# Altium schematic sheet Board2Board.SchDoc
size A4; CompanyName: Technische Hochschule Nürnberg Georg Simon Ohm; Organization: UltraZohm; Address1: Kesslerplatz 12; Address2: 90489 Nürnberg; Address3: GERMANY; SheetNumber: 2; SheetTotal: 36; Website: www.ultrazohm.com
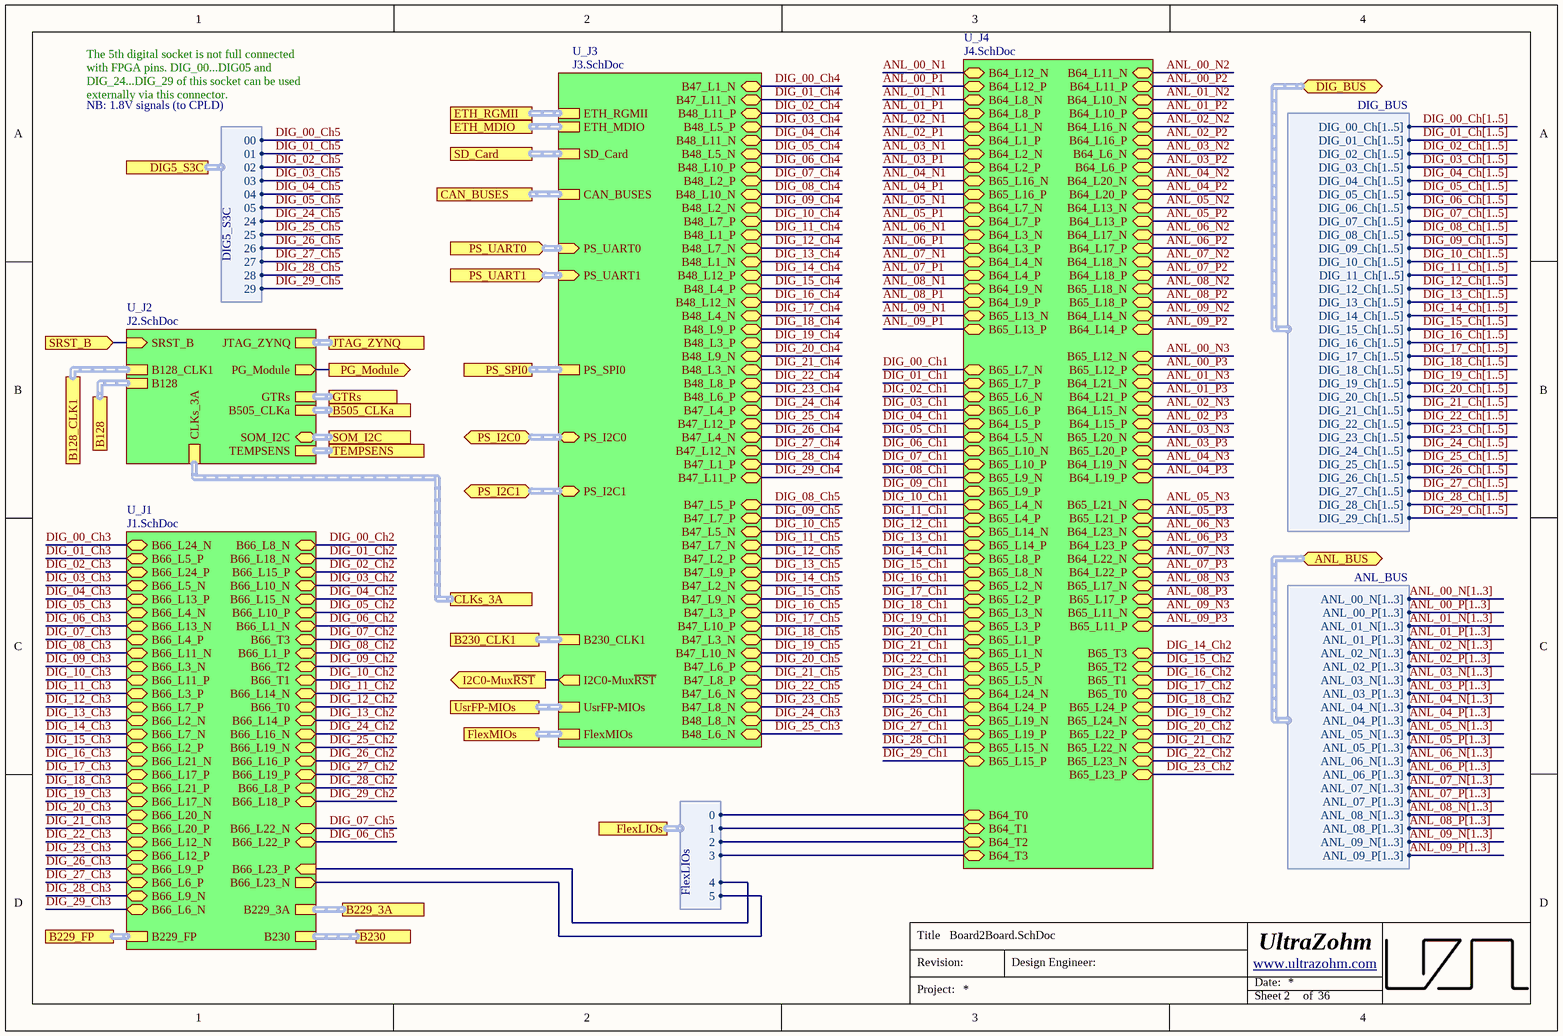
[diagram p0: Board2Board.SchDoc]

## Sub-sheets
U_J1 = J1.SchDoc: B66_L1_P (bidir), B66_L1_N (bidir), B66_L5_P (bidir), B66_L5_N (bidir), B66_L6_P (bidir), B66_L6_N (bidir), B66_L4_N (bidir), B66_L4_P (bidir), B66_L2_N (bidir), B66_L24_N (bidir), B66_L9_N (bidir), B66_L8_N (bidir), B66_L23_N (out), B66_L20_N (bidir), B66_L12_N (bidir), B66_L24_P (bidir), B66_L8_P (bidir), B66_L18_N (bidir), B66_L21_N (bidir), B66_L7_P (bidir), B66_L19_P (bidir), B66_L11_N (bidir), B66_L20_P (bidir), B66_L21_P (bidir), B66_L9_P (bidir), B66_L10_P (bidir), B66_L22_P (bidir), B66_L16_N (bidir), B66_L3_P (bidir), B66_L17_N (bidir), B66_L15_P (bidir), B66_L16_P (bidir), B66_L19_N (bidir), B66_L14_N (bidir), B66_L17_P (bidir), B66_L7_N (bidir), B66_L3_N (bidir), B66_L10_N (bidir), B66_L15_N (bidir), B66_L22_N (bidir), B66_L14_P (bidir), B66_L11_P (bidir), B66_L2_P (bidir), B66_L13_P (bidir), B66_L23_P (in), B66_L18_P (bidir), B66_L12_P (bidir), B66_L13_N (bidir), B66_T1 (bidir), B66_T2 (bidir), B66_T0 (bidir), B66_T3 (bidir), B229_3A (harness MGT3), B230 (harness MGT4), B229_FP (harness GTH)
U_J2 = J2.SchDoc: SRST_B (in), PG_Module (out), SOM_I2C (bidir, harness I2C), GTRs (harness GTRs), JTAG_ZYNQ (harness JTAG), TEMPSENS (harness T_DIODE), B505_CLKa (harness MGTCLK), CLKs_3A (harness CLKs_3A), B128 (harness MGT4), B128_CLK1 (harness MGTCLK)
U_J3 = J3.SchDoc: B48_L9_P (bidir), B47_L6_P (bidir), B48_L2_P (bidir), B48_L8_N (bidir), B48_L1_P (bidir), B47_L8_N (bidir), B47_L10_P (bidir), B47_L12_P (bidir), B47_L8_P (bidir), B47_L9_P (bidir), B48_L12_P (bidir), B48_L2_N (bidir), B47_L4_P (bidir), B47_L2_P (bidir), B47_L10_N (bidir), B48_L12_N (bidir), B47_L2_N (bidir), B47_L3_N (bidir), B48_L6_N (bidir), B48_L3_P (bidir), B47_L3_P (bidir), B47_L7_N (bidir), B48_L11_N (bidir), B48_L4_P (bidir), B47_L5_P (bidir), B47_L1_N (bidir), B47_L1_P (bidir), B47_L6_N (bidir), B48_L5_P (bidir), B48_L10_P (bidir), B47_L5_N (bidir), B48_L3_N (bidir), B47_L7_P (bidir), B48_L1_N (bidir), B48_L5_N (bidir), B47_L12_N (bidir), B48_L9_N (bidir), B48_L11_P (bidir), B47_L9_N (bidir), B48_L4_N (bidir), B47_L4_N (bidir), B48_L6_P (bidir), B47_L11_P (bidir), B48_L8_P (bidir), B48_L10_N (bidir), B47_L11_N (bidir), B48_L7_P (bidir), B48_L7_N (bidir), PS_UART0 (in, harness UART), PS_UART1 (in, harness UART), PS_I2C1 (bidir, harness I2C), PS_I2C0 (bidir, harness I2C), ETH_RGMII (harness ETH_RGMII), SD_Card (harness SD_Card), ETH_MDIO (harness ETH_MDIO), PS_SPI0 (harness SPI), CAN_BUSES (harness CAN_BUSES), UsrFP-MIOs (harness UsrFP-MIOs), FlexMIOs (harness FlexMIOs), I2C0-Mux~{RST} (out), B230_CLK1 (harness MGTCLK)
U_J4 = J4.SchDoc: B65_L1_N (bidir), B65_L1_P (bidir), B64_L9_N (bidir), B64_L5_P (bidir), B64_L9_P (bidir), B64_L4_P (bidir), B64_L7_N (bidir), B64_L2_N (bidir), B64_L4_N (bidir), B64_L12_N (bidir), B64_L1_P (bidir), B64_L12_P (bidir), B64_L10_N (bidir), B64_L8_N (bidir), B64_L6_P (bidir), B64_L7_P (bidir), B64_L5_N (bidir), B64_L3_P (bidir), B64_L6_N (bidir), B64_L3_N (bidir), B64_L1_N (bidir), B64_L2_P (bidir), B64_L11_N (bidir), B64_L10_P (bidir), B64_L8_P (bidir), B64_L11_P (bidir), B64_L21_P (bidir), B64_L19_P (bidir), B64_L16_N (bidir), B64_L13_P (bidir), B64_L14_P (bidir), B64_L17_N (bidir), B64_L18_N (bidir), B64_L16_P (bidir), B64_L20_P (bidir), B64_L24_P (bidir), B64_L15_P (bidir), B64_L13_N (bidir), B64_L14_N (bidir), B64_L23_P (bidir), B64_L24_N (bidir), B64_L15_N (bidir), B64_L19_N (bidir), B64_L17_P (bidir), B64_L22_P (bidir), B64_L20_N (bidir), B64_L22_N (bidir), B64_L23_N (bidir), B64_L18_P (bidir), B64_L21_N (bidir), B65_L5_P (bidir), B65_L9_P (bidir), B65_L10_P (bidir), B65_L8_P (bidir), B65_L10_N (bidir), B65_L2_N (bidir), B65_L11_P (bidir), B65_L6_N (bidir), B65_L11_N (bidir), B65_L4_P (bidir), B65_L8_N (bidir), B65_L5_N (bidir), B65_L7_N (bidir), B65_L7_P (bidir), B65_L12_P (bidir), B65_L3_P (bidir), B65_L12_N (bidir), B65_L3_N (bidir), B65_L4_N (bidir), B65_L2_P (bidir), B65_L6_P (bidir), B65_L9_N (bidir), B65_L16_P (bidir), B65_L23_N (bidir), B65_L13_N (bidir), B65_L13_P (bidir), B65_L16_N (bidir), B65_L24_P (bidir), B65_L21_P (bidir), B65_L15_N (bidir), B65_L17_N (bidir), B65_L18_P (bidir), B65_L20_N (bidir), B65_L19_P (bidir), B65_L21_N (bidir), B65_L15_P (bidir), B65_L22_N (bidir), B65_L23_P (bidir), B65_L17_P (bidir), B65_L22_P (bidir), B65_L24_N (bidir), B65_L19_N (bidir), B65_L18_N (bidir), B65_L20_P (bidir), B65_T1 (bidir), B65_T2 (bidir), B65_T3 (bidir), B65_T0 (bidir), B65_L14_N (bidir), B65_L14_P (bidir), B64_T0 (bidir), B64_T1 (bidir), B64_T2 (bidir), B64_T3 (bidir)

## Ports
ANL_BUS (bidir, harness ANL_BUS), B128 (harness MGT4), B128_CLK1 (harness MGTCLK), B229_3A (harness MGT3), B229_FP (harness GTH), B230 (harness MGT4), B230_CLK1 (harness MGTCLK), B505_CLKa (harness MGTCLK), CAN_BUSES (harness CAN_BUSES), CLKs_3A (harness CLKs_3A), DIG5_S3C (harness DIG5_S3C), DIG_BUS (bidir, harness DIG_BUS), ETH_MDIO (harness ETH_MDIO), ETH_RGMII (harness ETH_RGMII), FlexLIOs (harness FlexLIOs), FlexMIOs (harness FlexMIOs), GTRs (harness GTRs), I2C0-Mux~{RST} (out), JTAG_ZYNQ (harness JTAG), PG_Module (out), PS_I2C0 (bidir, harness I2C), PS_I2C1 (bidir, harness I2C), PS_SPI0 (harness SPI), PS_UART0 (in, harness UART), PS_UART1 (in, harness UART), SD_Card (harness SD_Card), SOM_I2C (harness I2C), SRST_B (in), TEMPSENS (harness T_DIODE), UsrFP-MIOs (harness UsrFP-MIOs)

## Harnesses
DIG_BUS: DIG_01_Ch[1..5], DIG_02_Ch[1..5], DIG_03_Ch[1..5], DIG_04_Ch[1..5], DIG_05_Ch[1..5], DIG_06_Ch[1..5], DIG_07_Ch[1..5], DIG_08_Ch[1..5], DIG_09_Ch[1..5], DIG_10_Ch[1..5], DIG_11_Ch[1..5], DIG_12_Ch[1..5], DIG_13_Ch[1..5], DIG_14_Ch[1..5], DIG_15_Ch[1..5], DIG_16_Ch[1..5], DIG_17_Ch[1..5], DIG_18_Ch[1..5], DIG_19_Ch[1..5], DIG_20_Ch[1..5], DIG_21_Ch[1..5], DIG_22_Ch[1..5], DIG_23_Ch[1..5], DIG_24_Ch[1..5], DIG_25_Ch[1..5], DIG_26_Ch[1..5], DIG_27_Ch[1..5], DIG_28_Ch[1..5], DIG_29_Ch[1..5], DIG_00_Ch[1..5]
ANL_BUS: ANL_00_N[1..3], ANL_00_P[1..3], ANL_01_N[1..3], ANL_01_P[1..3], ANL_02_N[1..3], ANL_02_P[1..3], ANL_03_N[1..3], ANL_03_P[1..3], ANL_04_N[1..3], ANL_04_P[1..3], ANL_05_N[1..3], ANL_05_P[1..3], ANL_06_N[1..3], ANL_06_P[1..3], ANL_07_N[1..3], ANL_07_P[1..3], ANL_08_N[1..3], ANL_08_P[1..3], ANL_09_N[1..3], ANL_09_P[1..3]
DIG5_S3C: 00, 01, 02, 03, 04, 05, 24, 25, 26, 27, 28, 29
FlexLIOs: 0, 1, 2, 3, 4, 5

## Nets
ANL_00_N1: sheet U_J4/B64_L12_N
ANL_00_N2: sheet U_J4/B64_L11_N
ANL_00_N3: sheet U_J4/B65_L12_N
ANL_00_P1: sheet U_J4/B64_L12_P
ANL_00_P2: sheet U_J4/B64_L11_P
ANL_00_P3: sheet U_J4/B65_L12_P
ANL_01_N1: sheet U_J4/B64_L8_N
ANL_01_N2: sheet U_J4/B64_L10_N
ANL_01_N3: sheet U_J4/B64_L21_N
ANL_01_P1: sheet U_J4/B64_L8_P
ANL_01_P2: sheet U_J4/B64_L10_P
ANL_01_P3: sheet U_J4/B64_L21_P
ANL_02_N1: sheet U_J4/B64_L1_N
ANL_02_N2: sheet U_J4/B64_L16_N
ANL_02_N3: sheet U_J4/B64_L15_N
ANL_02_P1: sheet U_J4/B64_L1_P
ANL_02_P2: sheet U_J4/B64_L16_P
ANL_02_P3: sheet U_J4/B64_L15_P
ANL_03_N1: sheet U_J4/B64_L2_N
ANL_03_N2: sheet U_J4/B64_L6_N
ANL_03_N3: sheet U_J4/B65_L20_N
ANL_03_P1: sheet U_J4/B64_L2_P
ANL_03_P2: sheet U_J4/B64_L6_P
ANL_03_P3: sheet U_J4/B65_L20_P
ANL_04_N1: sheet U_J4/B65_L16_N
ANL_04_N2: sheet U_J4/B64_L20_N
ANL_04_N3: sheet U_J4/B64_L19_N
ANL_04_P1: sheet U_J4/B65_L16_P
ANL_04_P2: sheet U_J4/B64_L20_P
ANL_04_P3: sheet U_J4/B64_L19_P
ANL_05_N1: sheet U_J4/B64_L7_N
ANL_05_N2: sheet U_J4/B64_L13_N
ANL_05_N3: sheet U_J4/B65_L21_N
ANL_05_P1: sheet U_J4/B64_L7_P
ANL_05_P2: sheet U_J4/B64_L13_P
ANL_05_P3: sheet U_J4/B65_L21_P
ANL_06_N1: sheet U_J4/B64_L3_N
ANL_06_N2: sheet U_J4/B64_L17_N
ANL_06_N3: sheet U_J4/B64_L23_N
ANL_06_P1: sheet U_J4/B64_L3_P
ANL_06_P2: sheet U_J4/B64_L17_P
ANL_06_P3: sheet U_J4/B64_L23_P
ANL_07_N1: sheet U_J4/B64_L4_N
ANL_07_N2: sheet U_J4/B64_L18_N
ANL_07_N3: sheet U_J4/B64_L22_N
ANL_07_P1: sheet U_J4/B64_L4_P
ANL_07_P2: sheet U_J4/B64_L18_P
ANL_07_P3: sheet U_J4/B64_L22_P
ANL_08_N1: sheet U_J4/B64_L9_N
ANL_08_N2: sheet U_J4/B65_L18_N
ANL_08_N3: sheet U_J4/B65_L17_N
ANL_08_P1: sheet U_J4/B64_L9_P
ANL_08_P2: sheet U_J4/B65_L18_P
ANL_08_P3: sheet U_J4/B65_L17_P
ANL_09_N1: sheet U_J4/B65_L13_N
ANL_09_N2: sheet U_J4/B64_L14_N
ANL_09_N3: sheet U_J4/B65_L11_N
ANL_09_P1: sheet U_J4/B65_L13_P
ANL_09_P2: sheet U_J4/B64_L14_P
ANL_09_P3: sheet U_J4/B65_L11_P
DIG_00_Ch1: sheet U_J4/B65_L7_N
DIG_00_Ch2: sheet U_J1/B66_L8_N
DIG_00_Ch3: sheet U_J1/B66_L24_N
DIG_00_Ch4: sheet U_J3/B47_L1_N
DIG_00_Ch5: port DIG5_S3C.00
DIG_01_Ch1: sheet U_J4/B65_L7_P
DIG_01_Ch2: sheet U_J1/B66_L18_N
DIG_01_Ch3: sheet U_J1/B66_L5_P
DIG_01_Ch4: sheet U_J3/B47_L11_N
DIG_01_Ch5: port DIG5_S3C.01
DIG_02_Ch1: sheet U_J4/B65_L6_N
DIG_02_Ch2: sheet U_J1/B66_L15_P
DIG_02_Ch3: sheet U_J1/B66_L24_P
DIG_02_Ch4: sheet U_J3/B48_L11_P
DIG_02_Ch5: port DIG5_S3C.02
DIG_03_Ch1: sheet U_J4/B65_L6_P
DIG_03_Ch2: sheet U_J1/B66_L10_N
DIG_03_Ch3: sheet U_J1/B66_L5_N
DIG_03_Ch4: sheet U_J3/B48_L5_P
DIG_03_Ch5: port DIG5_S3C.03
DIG_04_Ch1: sheet U_J4/B64_L5_P
DIG_04_Ch2: sheet U_J1/B66_L15_N
DIG_04_Ch3: sheet U_J1/B66_L13_P
DIG_04_Ch4: sheet U_J3/B48_L11_N
DIG_04_Ch5: port DIG5_S3C.04
DIG_05_Ch1: sheet U_J4/B64_L5_N
DIG_05_Ch2: sheet U_J1/B66_L10_P
DIG_05_Ch3: sheet U_J1/B66_L4_N
DIG_05_Ch4: sheet U_J3/B48_L5_N
DIG_05_Ch5: port DIG5_S3C.05
DIG_06_Ch1: sheet U_J4/B65_L10_N
DIG_06_Ch2: sheet U_J1/B66_L1_N
DIG_06_Ch3: sheet U_J1/B66_L13_N
DIG_06_Ch4: sheet U_J3/B48_L10_P
DIG_06_Ch5: sheet U_J1/B66_L22_P
DIG_07_Ch1: sheet U_J4/B65_L10_P
DIG_07_Ch2: sheet U_J1/B66_T3
DIG_07_Ch3: sheet U_J1/B66_L4_P
DIG_07_Ch4: sheet U_J3/B48_L2_P
DIG_07_Ch5: sheet U_J1/B66_L22_N
DIG_08_Ch1: sheet U_J4/B65_L9_N
DIG_08_Ch2: sheet U_J1/B66_L1_P
DIG_08_Ch3: sheet U_J1/B66_L11_N
DIG_08_Ch4: sheet U_J3/B48_L10_N
DIG_08_Ch5: sheet U_J3/B47_L5_P
DIG_09_Ch1: sheet U_J4/B65_L9_P
DIG_09_Ch2: sheet U_J1/B66_T2
DIG_09_Ch3: sheet U_J1/B66_L3_N
DIG_09_Ch4: sheet U_J3/B48_L2_N
DIG_09_Ch5: sheet U_J3/B47_L7_P
DIG_10_Ch1: sheet U_J4/B65_L4_N
DIG_10_Ch2: sheet U_J1/B66_T1
DIG_10_Ch3: sheet U_J1/B66_L11_P
DIG_10_Ch4: sheet U_J3/B48_L7_P
DIG_10_Ch5: sheet U_J3/B47_L5_N
DIG_11_Ch1: sheet U_J4/B65_L4_P
DIG_11_Ch2: sheet U_J1/B66_L14_N
DIG_11_Ch3: sheet U_J1/B66_L3_P
DIG_11_Ch4: sheet U_J3/B48_L1_P
DIG_11_Ch5: sheet U_J3/B47_L7_N
DIG_12_Ch1: sheet U_J4/B65_L14_N
DIG_12_Ch2: sheet U_J1/B66_T0
DIG_12_Ch3: sheet U_J1/B66_L7_P
DIG_12_Ch4: sheet U_J3/B48_L7_N
DIG_12_Ch5: sheet U_J3/B47_L2_P
DIG_13_Ch1: sheet U_J4/B65_L14_P
DIG_13_Ch2: sheet U_J1/B66_L14_P
DIG_13_Ch3: sheet U_J1/B66_L2_N
DIG_13_Ch4: sheet U_J3/B48_L1_N
DIG_13_Ch5: sheet U_J3/B47_L9_P
DIG_14_Ch1: sheet U_J4/B65_L8_P
DIG_14_Ch2: sheet U_J4/B65_T3
DIG_14_Ch3: sheet U_J1/B66_L7_N
DIG_14_Ch4: sheet U_J3/B48_L12_P
DIG_14_Ch5: sheet U_J3/B47_L2_N
DIG_15_Ch1: sheet U_J4/B65_L8_N
DIG_15_Ch2: sheet U_J4/B65_T2
DIG_15_Ch3: sheet U_J1/B66_L2_P
DIG_15_Ch4: sheet U_J3/B48_L4_P
DIG_15_Ch5: sheet U_J3/B47_L9_N
DIG_16_Ch1: sheet U_J4/B65_L2_N
DIG_16_Ch2: sheet U_J4/B65_T1
DIG_16_Ch3: sheet U_J1/B66_L21_N
DIG_16_Ch4: sheet U_J3/B48_L12_N
DIG_16_Ch5: sheet U_J3/B47_L3_P
DIG_17_Ch1: sheet U_J4/B65_L2_P
DIG_17_Ch2: sheet U_J4/B65_T0
DIG_17_Ch3: sheet U_J1/B66_L17_P
DIG_17_Ch4: sheet U_J3/B48_L4_N
DIG_17_Ch5: sheet U_J3/B47_L10_P
DIG_18_Ch1: sheet U_J4/B65_L3_N
DIG_18_Ch2: sheet U_J4/B65_L24_P
DIG_18_Ch3: sheet U_J1/B66_L21_P
DIG_18_Ch4: sheet U_J3/B48_L9_P
DIG_18_Ch5: sheet U_J3/B47_L3_N
DIG_19_Ch1: sheet U_J4/B65_L3_P
DIG_19_Ch2: sheet U_J4/B65_L24_N
DIG_19_Ch3: sheet U_J1/B66_L17_N
DIG_19_Ch4: sheet U_J3/B48_L3_P
DIG_19_Ch5: sheet U_J3/B47_L10_N
DIG_20_Ch1: sheet U_J4/B65_L1_P
DIG_20_Ch2: sheet U_J4/B65_L22_P
DIG_20_Ch3: sheet U_J1/B66_L20_N
DIG_20_Ch4: sheet U_J3/B48_L9_N
DIG_20_Ch5: sheet U_J3/B47_L6_P
DIG_21_Ch1: sheet U_J4/B65_L1_N
DIG_21_Ch2: sheet U_J4/B65_L22_N
DIG_21_Ch3: sheet U_J1/B66_L20_P
DIG_21_Ch4: sheet U_J3/B48_L3_N
DIG_21_Ch5: sheet U_J3/B47_L8_P
DIG_22_Ch1: sheet U_J4/B65_L5_P
DIG_22_Ch2: sheet U_J4/B65_L23_N
DIG_22_Ch3: sheet U_J1/B66_L12_N
DIG_22_Ch4: sheet U_J3/B48_L8_P
DIG_22_Ch5: sheet U_J3/B47_L6_N
DIG_23_Ch1: sheet U_J4/B65_L5_N
DIG_23_Ch2: sheet U_J4/B65_L23_P
DIG_23_Ch3: sheet U_J1/B66_L12_P
DIG_23_Ch4: sheet U_J3/B48_L6_P
DIG_23_Ch5: sheet U_J3/B47_L8_N
DIG_24_Ch1: sheet U_J4/B64_L24_N
DIG_24_Ch2: sheet U_J1/B66_L16_N
DIG_24_Ch3: sheet U_J3/B48_L8_N
DIG_24_Ch4: sheet U_J3/B47_L4_P
DIG_24_Ch5: port DIG5_S3C.24
DIG_25_Ch1: sheet U_J4/B64_L24_P
DIG_25_Ch2: sheet U_J1/B66_L19_N
DIG_25_Ch3: sheet U_J3/B48_L6_N
DIG_25_Ch4: sheet U_J3/B47_L12_P
DIG_25_Ch5: port DIG5_S3C.25
DIG_26_Ch1: sheet U_J4/B65_L19_N
DIG_26_Ch2: sheet U_J1/B66_L16_P
DIG_26_Ch3: sheet U_J1/B66_L9_P
DIG_26_Ch4: sheet U_J3/B47_L4_N
DIG_26_Ch5: port DIG5_S3C.26
DIG_27_Ch1: sheet U_J4/B65_L19_P
DIG_27_Ch2: sheet U_J1/B66_L19_P
DIG_27_Ch3: sheet U_J1/B66_L6_P
DIG_27_Ch4: sheet U_J3/B47_L12_N
DIG_27_Ch5: port DIG5_S3C.27
DIG_28_Ch1: sheet U_J4/B65_L15_N
DIG_28_Ch2: sheet U_J1/B66_L8_P
DIG_28_Ch3: sheet U_J1/B66_L9_N
DIG_28_Ch4: sheet U_J3/B47_L1_P
DIG_28_Ch5: port DIG5_S3C.28
DIG_29_Ch1: sheet U_J4/B65_L15_P
DIG_29_Ch2: sheet U_J1/B66_L18_P
DIG_29_Ch3: sheet U_J1/B66_L6_N
DIG_29_Ch4: sheet U_J3/B47_L11_P
DIG_29_Ch5: port DIG5_S3C.29
I2C0-Mux~{RST}: port I2C0-Mux~{RST}, sheet U_J3/I2C0-Mux~{RST}
PG_Module: port PG_Module, sheet U_J2/PG_Module
SRST_B: port SRST_B, sheet U_J2/SRST_B
(unnamed): sheet U_J1/B66_L23_N, port FlexLIOs.5
(unnamed): sheet U_J1/B66_L23_P, port FlexLIOs.4
(unnamed): sheet U_J4/B64_T0, port FlexLIOs.0
(unnamed): sheet U_J4/B64_T1, port FlexLIOs.1
(unnamed): sheet U_J4/B64_T2, port FlexLIOs.2
(unnamed): sheet U_J4/B64_T3, port FlexLIOs.3

## Buses and harness runs
bus ANL_00_N[1..3]
bus ANL_00_P[1..3]
bus ANL_01_N[1..3]
bus ANL_01_P[1..3]
bus ANL_02_N[1..3]
bus ANL_02_P[1..3]
bus ANL_03_N[1..3]
bus ANL_03_P[1..3]
bus ANL_04_N[1..3]
bus ANL_04_P[1..3]
bus ANL_05_N[1..3]
bus ANL_05_P[1..3]
bus ANL_06_N[1..3]
bus ANL_06_P[1..3]
bus ANL_07_N[1..3]
bus ANL_07_P[1..3]
bus ANL_08_N[1..3]
bus ANL_08_P[1..3]
bus ANL_09_N[1..3]
bus ANL_09_P[1..3]
bus DIG_00_Ch[1..5]
bus DIG_01_Ch[1..5]
bus DIG_02_Ch[1..5]
bus DIG_03_Ch[1..5]
bus DIG_04_Ch[1..5]
bus DIG_05_Ch[1..5]
bus DIG_06_Ch[1..5]
bus DIG_07_Ch[1..5]
bus DIG_08_Ch[1..5]
bus DIG_09_Ch[1..5]
bus DIG_10_Ch[1..5]
bus DIG_11_Ch[1..5]
bus DIG_12_Ch[1..5]
bus DIG_13_Ch[1..5]
bus DIG_14_Ch[1..5]
bus DIG_15_Ch[1..5]
bus DIG_16_Ch[1..5]
bus DIG_17_Ch[1..5]
bus DIG_18_Ch[1..5]
bus DIG_19_Ch[1..5]
bus DIG_20_Ch[1..5]
bus DIG_21_Ch[1..5]
bus DIG_22_Ch[1..5]
bus DIG_23_Ch[1..5]
bus DIG_24_Ch[1..5]
bus DIG_25_Ch[1..5]
bus DIG_26_Ch[1..5]
bus DIG_27_Ch[1..5]
bus DIG_28_Ch[1..5]
bus DIG_29_Ch[1..5]
harness port B128 = sheet U_J2/B128
harness port B128_CLK1 = sheet U_J2/B128_CLK1
harness port B229_3A = sheet U_J1/B229_3A
harness port B229_FP = sheet U_J1/B229_FP
harness port B230 = sheet U_J1/B230
harness port B230_CLK1 = sheet U_J3/B230_CLK1
harness port B505_CLKa = sheet U_J2/B505_CLKa
harness port CAN_BUSES = sheet U_J3/CAN_BUSES
harness port CLKs_3A = sheet U_J2/CLKs_3A
harness port ETH_MDIO = sheet U_J3/ETH_MDIO
harness port ETH_RGMII = sheet U_J3/ETH_RGMII
harness port FlexMIOs = sheet U_J3/FlexMIOs
harness port GTRs = sheet U_J2/GTRs
harness port JTAG_ZYNQ = sheet U_J2/JTAG_ZYNQ
harness port PS_I2C0 = sheet U_J3/PS_I2C0
harness port PS_I2C1 = sheet U_J3/PS_I2C1
harness port PS_SPI0 = sheet U_J3/PS_SPI0
harness port PS_UART0 = sheet U_J3/PS_UART0
harness port PS_UART1 = sheet U_J3/PS_UART1
harness port SD_Card = sheet U_J3/SD_Card
harness port SOM_I2C = sheet U_J2/SOM_I2C
harness port TEMPSENS = sheet U_J2/TEMPSENS
harness port UsrFP-MIOs = sheet U_J3/UsrFP-MIOs

## Notes on the sheet
- The 5th digital socket is not full connected with FPGA pins. DIG_00...DIG05 and DIG_24...DIG_29 of this socket can be used externally via this connector.
- NB: 1.8V signals (to CPLD)
- Title
- Revision:
- Design Engineer:
- Date:
- Project:
- Sheet
- of